# EasyEDA schematic schematic.json
TITLE: Sheet_1; REV: 1.0; Date: 2024-11-29; Sheet: 1/1; Drawn By: anne; Company: Your Company
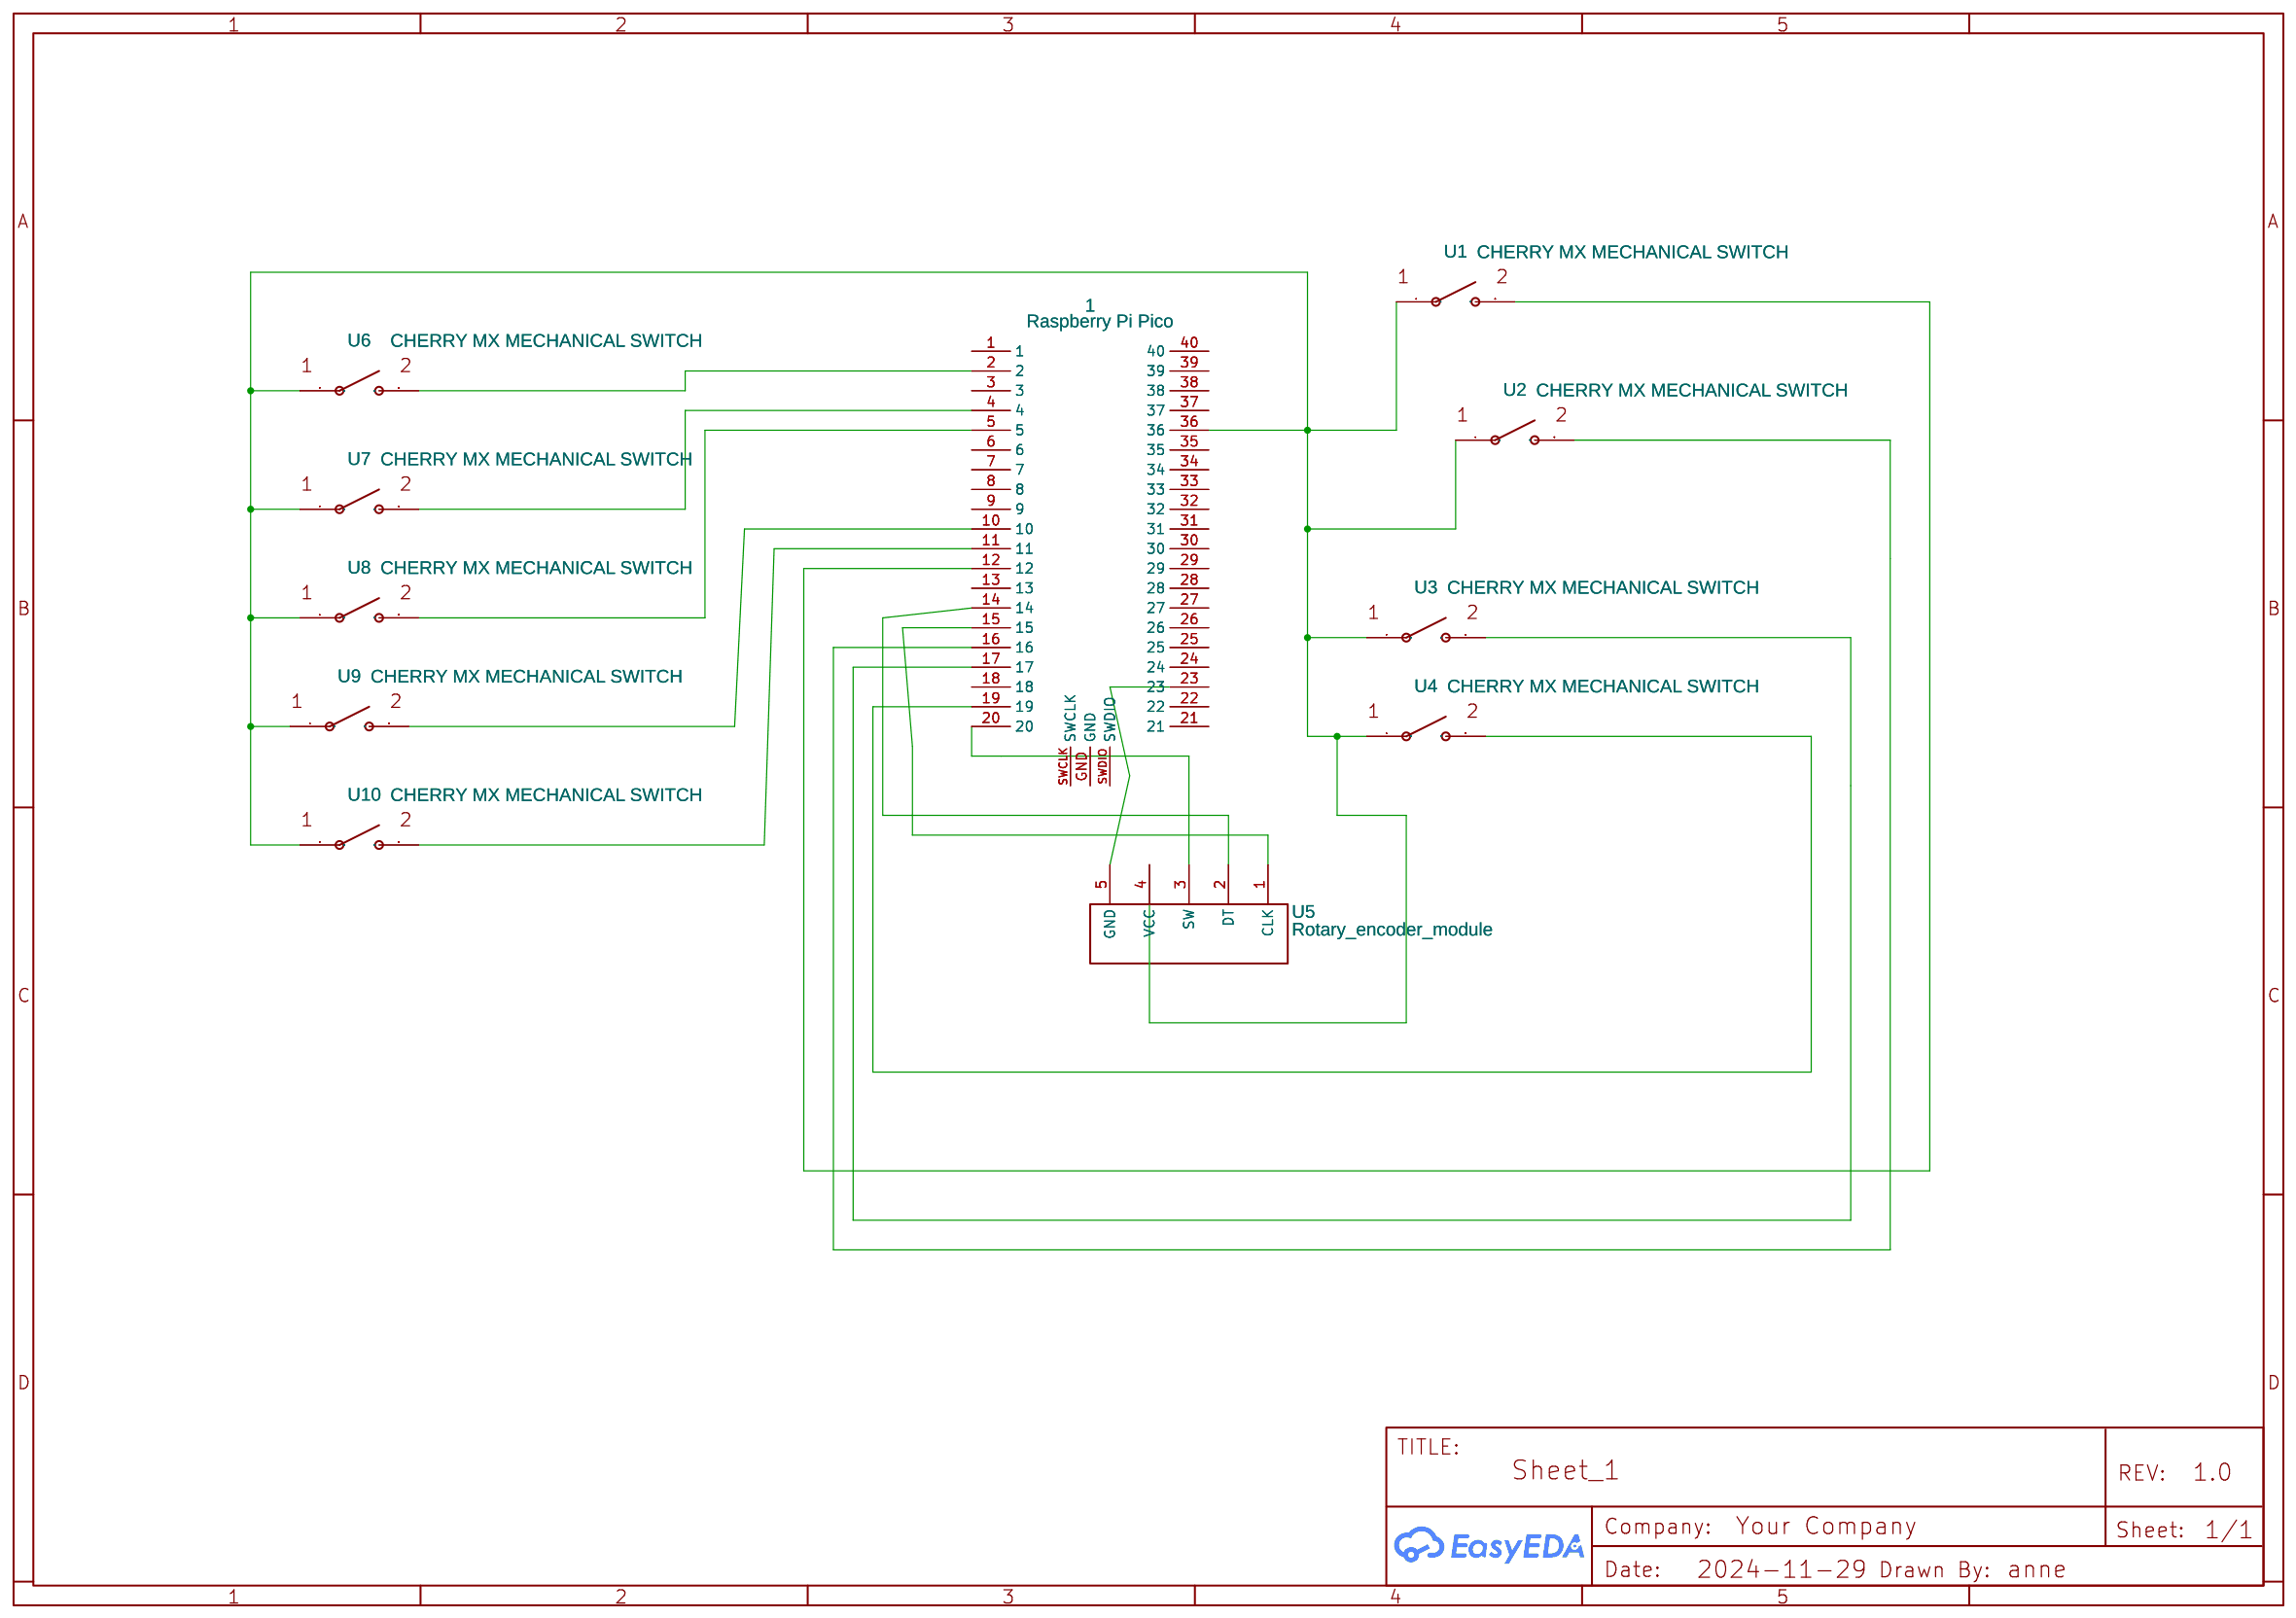
[diagram p0: schematic sheet]

## Parts
1  Raspberry Pi Pico  [FT_RASPBERRY-PI-PICO_TH]
U1  CHERRY MX MECHANICAL SWITCH  [CHERRY MX KEYSWITCH]
U2  CHERRY MX MECHANICAL SWITCH  [CHERRY MX KEYSWITCH]
U3  CHERRY MX MECHANICAL SWITCH  [CHERRY MX KEYSWITCH]
U4  CHERRY MX MECHANICAL SWITCH  [CHERRY MX KEYSWITCH]
U5  Rotary_encoder_module  [ROTARY ENCODER MODULE]
U6  CHERRY MX MECHANICAL SWITCH  [CHERRY MX KEYSWITCH]
U7  CHERRY MX MECHANICAL SWITCH  [CHERRY MX KEYSWITCH]
U8  CHERRY MX MECHANICAL SWITCH  [CHERRY MX KEYSWITCH]
U9  CHERRY MX MECHANICAL SWITCH  [CHERRY MX KEYSWITCH]
U10  CHERRY MX MECHANICAL SWITCH  [CHERRY MX KEYSWITCH]

## Library data of the parts
1 = Raspberry1: Contributor: Diego Alejandro Mesa Vargas
U1-U4 U6-U10 = CHERRY MX MECHANICAL SWITCH: Contributor: clay53
U5 = Rotary_encoder_module: Supplier Part: undefined; Contributor: Geerten1997

## Nets
Net-(1-2): 1.2 U6.2
Net-(1-4): 1.4 U7.2
Net-(1-5): 1.5 U8.2
Net-(1-10): 1.10 U9.2
Net-(1-11): 1.11 U10.2
Net-(1-12): 1.12 U1.2
Net-(1-14): 1.14 U5.2(DT)
Net-(1-15): 1.15 U5.1(CLK)
Net-(1-16): 1.16 U2.2
Net-(1-17): 1.17 U3.2
Net-(1-19): 1.19 U4.2
Net-(1-20): 1.20 U5.3(SW)
Net-(1-36): 1.36 U1.1 U2.1 U3.1 U4.1 U5.4(VCC) U6.1 U7.1 U8.1 U9.1 U10.1

Not connected (* = marked no-connect by the designer): 1 1 3 6 7 8 9 13 18 21 22 23 24 25 26 27 28 29 30 31 32 33 34 35 37 38 39 40 GND SWCLK SWDIO; U5 5(GND)
